# Altium schematic sheet battery monitor v2.0.SchDoc
size A; SheetNumber: 2; SheetTotal: 3
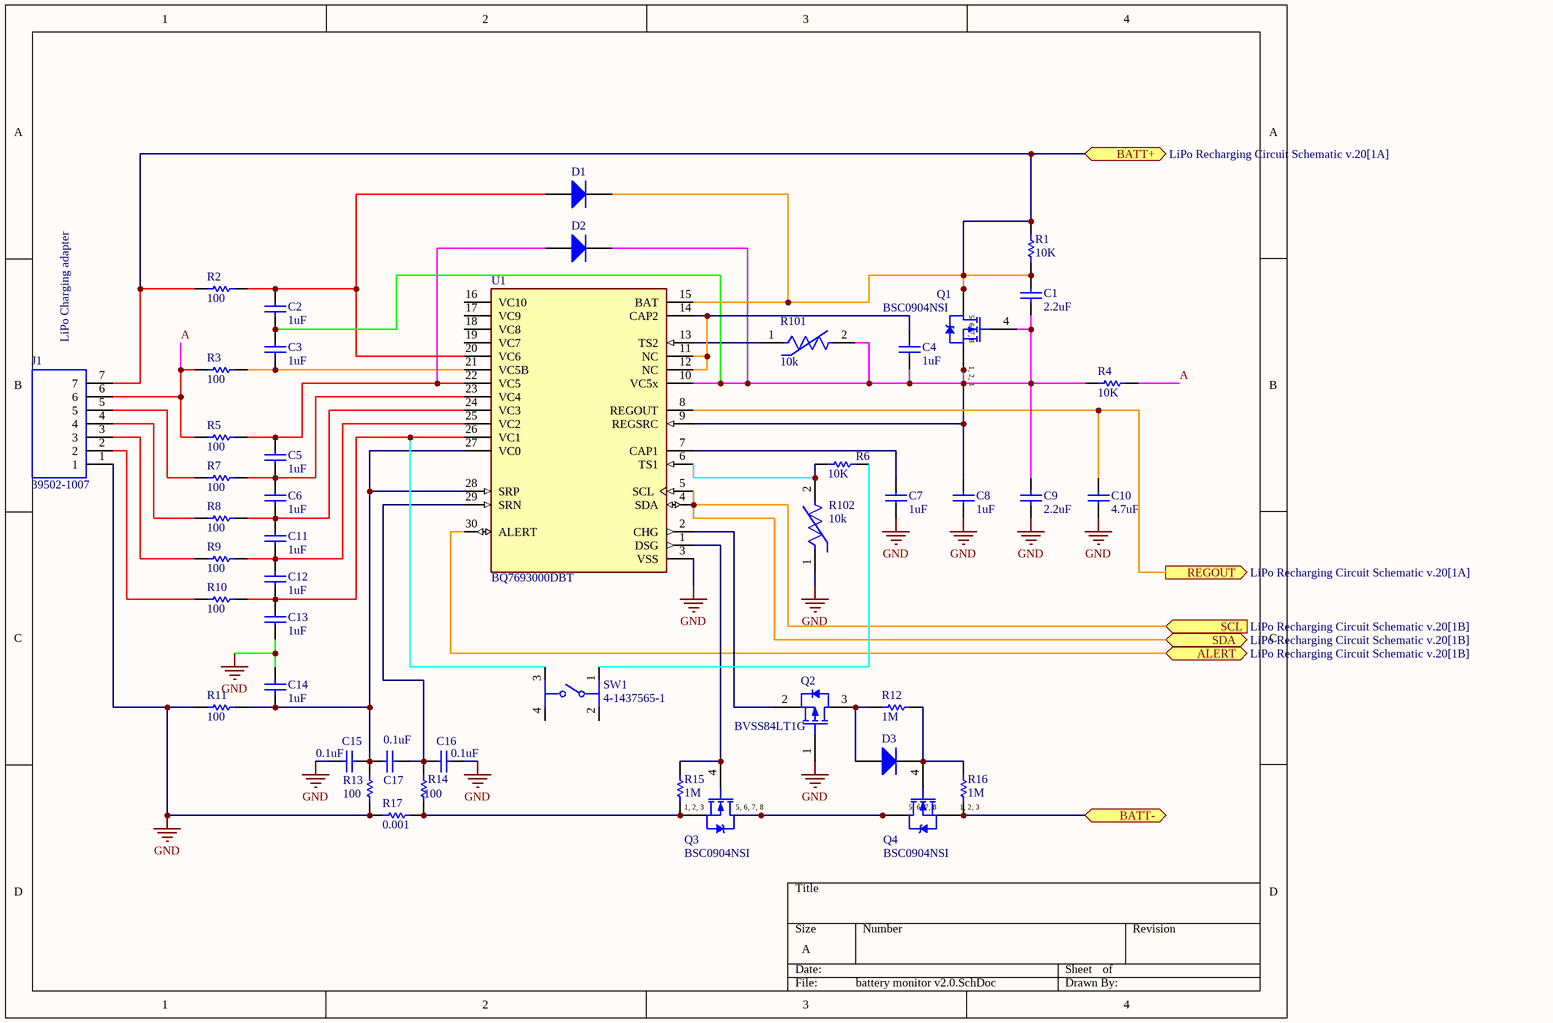
[diagram p0: battery monitor v2.0.SchDoc]

## Parts
C1  value 2.2uF  [CAPC2012X145N]  (hidden comment: Capacitor)
C2  value 1uF  [CAPC2012X145N]  (hidden comment: Capacitor)
C3  value 1uF  [CAPC2012X145N]  (hidden comment: Capacitor)
C4  value 1uF  [CAPC2012X145N]  (hidden comment: Capacitor)
C5  value 1uF  [CAPC2012X145N]  (hidden comment: Capacitor)
C6  value 1uF  [CAPC2012X145N]  (hidden comment: Capacitor)
C7  value 1uF  [CAPC2012X145N]  (hidden comment: Capacitor)
C8  value 1uF  [CAPC2012X145N]  (hidden comment: Capacitor)
C9  value 2.2uF  [CAPC2012X145N]  (hidden comment: Capacitor)
C10  value 4.7uF  [CAPC2012X145N]  (hidden comment: Capacitor)
C11  value 1uF  [CAPC2012X145N]  (hidden comment: Capacitor)
C12  value 1uF  [CAPC2012X145N]  (hidden comment: Capacitor)
C13  value 1uF  [CAPC2012X145N]  (hidden comment: Capacitor)
C14  value 1uF  [CAPC2012X145N]  (hidden comment: Capacitor)
C15  value 0.1uF  [CAPC2012X145N]  (hidden comment: Capacitor)
C16  value 0.1uF  [CAPC2012X145N]  (hidden comment: Capacitor)
C17  value 0.1uF  [CAPC2012X145N]  (hidden comment: Capacitor)
D1  1N4001-T  [DIOD-DO-41-P-2_V]  (value not drawn)
D2  1N4001-T  [DIOD-DO-41-P-2_V]  (value not drawn)
D3  1N4001-T  [DIOD-DO-41-P-2_V]  (value not drawn)
J1  39502-1007  [SHDRRA7W80P0X350_1X7_2590X920X730P]
Q1  BSC0904NSI  [INF-PG-TDSON-8-1_V]
Q2  BVSS84LT1G  [ONSC-SOT-23-3-318-08_V]
Q3  BSC0904NSI  [INF-PG-TDSON-8-1_V]
Q4  BSC0904NSI  [INF-PG-TDSON-8-1_V]
R1  value 10K  [CAPC2012X145N]  (hidden comment: Resistor)
R2  value 100  [CAPC2012X145N]  (hidden comment: Resistor)
R3  value 100  [CAPC2012X145N]  (hidden comment: Resistor)
R4  value 10K  [CAPC2012X145N]  (hidden comment: Resistor)
R5  value 100  [CAPC2012X145N]  (hidden comment: Resistor)
R6  value 10K  [CAPC2012X145N]  (hidden comment: Resistor)
R7  value 100  [CAPC2012X145N]  (hidden comment: Resistor)
R8  value 100  [CAPC2012X145N]  (hidden comment: Resistor)
R9  value 100  [CAPC2012X145N]  (hidden comment: Resistor)
R10  value 100  [CAPC2012X145N]  (hidden comment: Resistor)
R11  value 100  [CAPC2012X145N]  (hidden comment: Resistor)
R12  value 1M  [CAPC2012X145N]  (hidden comment: Resistor)
R13  value 100  [CAPC2012X145N]  (hidden comment: Resistor)
R14  value 100  [CAPC2012X145N]  (hidden comment: Resistor)
R15  value 1M  [CAPC2012X145N]  (hidden comment: Resistor)
R16  value 1M  [CAPC2012X145N]  (hidden comment: Resistor)
R17  value 0.001  [CAPC2012X145N]  (hidden comment: Resistor)
R101  10k  [FP-NCU18-0_15-IPC_B]
R102  10k  [FP-NCU18-0_15-IPC_B]
SW1  4-1437565-1  [FP-4-1437565-1-MFG]
U1  BQ7693000DBT  [FP-DBT0030A-IPC_A]

## Ports
ALERT (bidir, see LiPo Recharging Circuit Schematic v.20[1B]), BATT+ (bidir, see LiPo Recharging Circuit Schematic v.20[1A]), BATT- (bidir), REGOUT (out, see LiPo Recharging Circuit Schematic v.20[1A]), SCL (in, see LiPo Recharging Circuit Schematic v.20[1B]), SDA (bidir, see LiPo Recharging Circuit Schematic v.20[1B])

## Nets
GND: C7.1 C8.1 C9.1 C10.1 C13.1 C14.2 C15.2 C16.1 J1.1 Q2.1(G) R11.2 R13.2 R17.1 R102.1 U1.3(VSS)
A: J1.6 R3.2 R4.1 R5.2
ALERT: U1.30(ALERT) ; port ALERT
BATT+: C1.2 D1.2(K) J1.7 Q1.5(DRAIN) Q1.6(DRAIN) Q1.7(DRAIN) Q1.8(DRAIN) R1.1 R1.2 R2.2 U1.15(BAT) ; port BATT+
BATT-: Q4.1(SOURCE) Q4.2(SOURCE) Q4.3(SOURCE) R16.1 ; port BATT-
REGOUT: C10.2 U1.8(REGOUT) ; port REGOUT
SCL: U1.4(SDA) U1.5(SCL) ; port SCL, port SDA
NetC1_1: C1.1 C2.1 C3.2 C4.1 C8.2 C9.2 D2.2(K) Q1.1(SOURCE) Q1.2(SOURCE) Q1.3(SOURCE) Q1.4(GATE) R4.2 R101.2 U1.9(REGSRC) U1.10(VC5x)
NetC2_2: C2.2 D1.1(A) R2.1 U1.20(VC6)
NetC3_1: C3.1 R3.1 U1.21(VC5B)
NetC4_2: C4.2 U1.11(NC) U1.12(NC) U1.14(CAP2)
NetC5_1: C5.1 C6.2 R7.1 U1.23(VC4)
NetC5_2: C5.2 D2.1(A) R5.1 U1.22(VC5)
NetC6_1: C6.1 C11.2 R8.1 U1.24(VC3)
NetC7_2: C7.2 U1.7(CAP1)
NetC11_1: C11.1 C12.2 R9.1 U1.25(VC2)
NetC12_1: C12.1 C13.2 R10.1 SW1.3 U1.26(VC1)
NetC14_1: C14.1 C15.1 C17.2 R11.1 R13.1 U1.27(VC0) U1.28(SRP)
NetC16_2: C16.2 C17.1 R14.1 U1.29(SRN)
NetD3_1: D3.1(A) Q2.3(D) R12.2
NetD3_2: D3.2(K) Q4.4(GATE) R12.1 R16.2
NetJ1_2: J1.2 R10.2
NetJ1_3: J1.3 R9.2
NetJ1_4: J1.4 R8.2
NetJ1_5: J1.5 R7.2
NetQ2_2: Q2.2(S) U1.2(CHG)
NetQ3_1: Q3.1(SOURCE) Q3.2(SOURCE) Q3.3(SOURCE) R14.2 R15.1 R17.2
NetQ3_4: Q3.4(GATE) R15.2 U1.1(DSG)
NetQ3_5: Q3.5(DRAIN) Q3.6(DRAIN) Q3.7(DRAIN) Q3.8(DRAIN) Q4.5(DRAIN) Q4.6(DRAIN) Q4.7(DRAIN) Q4.8(DRAIN)
NetR6_1: R6.1 SW1.1
NetR6_2: R6.2 R102.2 U1.6(TS1)
NetR101_1: R101.1 U1.13(TS2)

Not connected (* = marked no-connect by the designer): SW1 2 4; U1 16(VC10) 17(VC9) 18(VC8) 19(VC7)

## Notes on the sheet
- (near J1) LiPo Charging adapter
- (in symbol CMP-1090-00063-1) 1, 2, 3; 5, 6, 7, 8

## Library data of the parts
C1-C17 = Capacitor: SimulationGenericComponent: True
D1-D3 = CMP-0639-00006-2: 1.0 A Rectifier, 15 pF, 50 V, -65 to 150 degC, 2-Pin DO-41 Plastic, RoHS, Tape and Reel; Manufacturer: Diodes Inc; VF (V): 1; CT (pF): 15; Max. IR (uA): 5; VRRM (V): 50; Max. IFSM (A): 30; RoHS: TRUE; Mounting Technology: Through Hole; PartNumber: 1N4001-T; ComponentLink2Description: Datasheet; DatasheetVersion: Rev. 8-2; Operating Temperature Range (degC): -65 to 150; Packing: Tape and Reel; PackageReference: DO-41-P-2; ComponentLink1URL: http://diodes.com/; PackageDescription: 2-Pin Axial Lead, Body 4.635 x 2.36 mm, Lead Spread 25.4 mm; ComponentLink2URL: http://diodes.com/datasheets/ds28002.pdf; Max. Average Rectified Current IO (A): 1; ComponentLink1Description: Manufacturer URL
J1 = 39502-1007: Pluggable Terminal Blocks 3.5MM HOR PCB HDR 7 CIRCUITS; Manufacturer_Name: Molex; Geometry.Height: 7.3mm; Mouser Part Number: 538-39502-1007; Mouser Price/Stock: https://www.mouser.co.uk/ProductDetail/Molex/39502-1007?qs=haJlXwgIYR0hhSR3z4BP8g%3D%3D; Manufacturer_Part_Number: 39502-1007; Datasheet Link: https://www.molex.com/pdm_docs/sd/395021007_sd.pdf
Q1 Q3 Q4 = CMP-1090-00063-1: N-Channel OptiMOS Power-MOSFET, 30 V VDS, 78 A ID, -55 to 150 degC, PG-TDSON-8-1, Reel, Green; Manufacturer: Infineon; VDS (max): 30Â V; Ptot (max): 37Â W; RthJC (max): 3.4Â K/W; RDS (on) (max): 3.7Â mOhm; ID (max): 78Â A; Polarity: N; RDS (on) (max) (@4.5V): 5.2Â mOhm; IDpuls (max): 312Â A; VGS(th) (min): 1Â V; QG: 17Â nC; VGS(th) (max): 2.2Â V; Green: TRUE; RthJA (max): 50Â K/W; ComponentLink1URL: http://www.infineon.com/; ComponentLink3URL: http://www.infineon.com/cms/packages/SMD_-_Surface_Mounted_Devices/P-PG-TDSON/P-PG-TDSON-08-01x_2x_3.html?__locale=en; DatasheetVersion: Rev. 2.2; Mounting Technology: Surface Mount; PackageReference: PG-TDSON-8-1; ComponentLink2URL: http://www.infineon.com/dgdl/BSC0904NSI_Rev+2.2.pdf?folderId=db3a304313b8b5a60113cee8763b02d7&fileId=db3a30432f29829e012f3073397339ef; PartNumber: BSC0904NSI; ComponentLink3Description: Package Specification; ComponentLink1Description: Manufacturer URL; Rth: 3.4Â K/W; ComponentLink2Description: Datasheet; Packing: Reel; PackageDescription: 8-Pin Plastic (Green) Thin Dual Small Outline Non-Leaded Package, 5.15 x 5.9 mm Body, 1.27 mm Pitch; Halogen-free: TRUE
Q2 = CMP-1058-00764-1: Power MOSFET Single P-Channel, -50 V, 10 Ohm, 3-Pin SOT-23, Pb-Free, Tape and Reel; Manufacturer: On Semiconductor; VGS Max (V): 20; Crss Typ (pF): 6.5; Channel Polarity: P Channel; Coss Typ (pF): 17; VGS(th) Max (V): 2; PD Max (W): 0.225; V(BR)DSS Min (V): 50; ID Max (A): 0.13; Ciss Typ (pF): 36; PackageDescription: 3-Pin Small Outline Transistor, Body 2.92 x 1.3 mm, Pitch 0.95 mm; Mounting Technology: Surface Mount; ComponentLink2Description: Datasheet; ComponentLink1Description: Manufacturer URL; RoHS: Pb-Free; ComponentLink2URL: http://www.onsemi.com/pub_link/Collateral/BSS84LT1-D.PDF; Package Type: SOT-23-3; PackageReference: SOT-23-3-318-08; ComponentLink3URL: http://www.onsemi.cn/pub_link/Collateral/318-08.PDF; ComponentLink3Description: Package Specification; Configuration: Single; PackageVersion: Rev. AP, 11/2009; ComponentLink1URL: http://www.onsemi.com/; DatasheetVersion: Rev. 8; PartNumber: BVSS84LT1G; Packing: Tape and Reel
R1-R17 = Resistor: TC1: 0; SimulationGenericComponent: True; TC2: 0
R101 R102 = CMP-06022-000547-2: THERMISTOR NTC; Min Operating Temperature: -40°C; Case Code (Metric): 1608; Max Operating Temperature: 150°C; RoHS Compliant: Yes; Case/Package: 0603; Case Code (Imperial): 0603; REACH SVHC: No SVHC
SW1 = CMP-03407-000003-1: SWITCH TACTILE SPST-NO 0.05A 24V; Manufacturer: TE Connectivity; Ciiva Ids: 2672442; Contact Current Rating: 50mA; Operating Force: 160gf; Contact Resistance: 100mΩ; Electromechanical Life: 100000Cycles; Standoff Height: 0.05mm; Import Ts: 1521848451; Category: Switch; ComponentLink2Description: Datasheet; Mount: Surface Mount; Digikey Description: SWITCH TACTILE SPST-NO 0.05A 24V; Device Class L3: Tactile Switches; Release Date: 1503379960; Octopart: https://octopart.com/fsm4jsma-te+connectivity-55488004; Temperature Range Low: -35°C; Lead Free: Yes; RoHS: TRUE; Mouser Description: Switch Tactile OFF (ON) SPST Round Button Gull Wing 0.05A 12VDC 1.57N SMD Loose Piece; Voltage Rating Dc: 24V; ComponentLink2URL: https://www.te.com/commerce/DocumentDelivery/DDEController?Action=showdoc&DocId=Customer+Drawing%7F2-1437565-7%7FV%7Fpdf%7FEnglish%7FENG_CD_2-1437565-7_V.pdf%7F4-1437565-1; Height: 5.38mm; Package: 0; Temperature Range High: +85°C; Device Class L2: Switches; Manufacturer Part Number: 4-1437565-1; Temperature: -35°C to +85°C; Device Class L1: Electromechanical; Automotive: No; Throw Configuration: SPST-NO
U1 = CMP-04911-000035-1: IC BATT MGMT LI-ION AFE 30TSSOP; Interface: I2C; Output Voltage: 3.6V; Fault Protection: Over Current; Operating Supply Voltage: 25V; Weight: 0.003439oz; Package Quantity: 60; Packaging: Rail/Tube; Lead Free: Lead Free; Case/Package: TSSOP; Min Operating Temperature: -40°C; Number of Pins: 30; RoHS Compliant: Yes; Max Operating Temperature: 85°C; Mount: Surface Mount; Contact Plating: Gold